# Altium project IOT_CCM_RP2040.PrjPcb
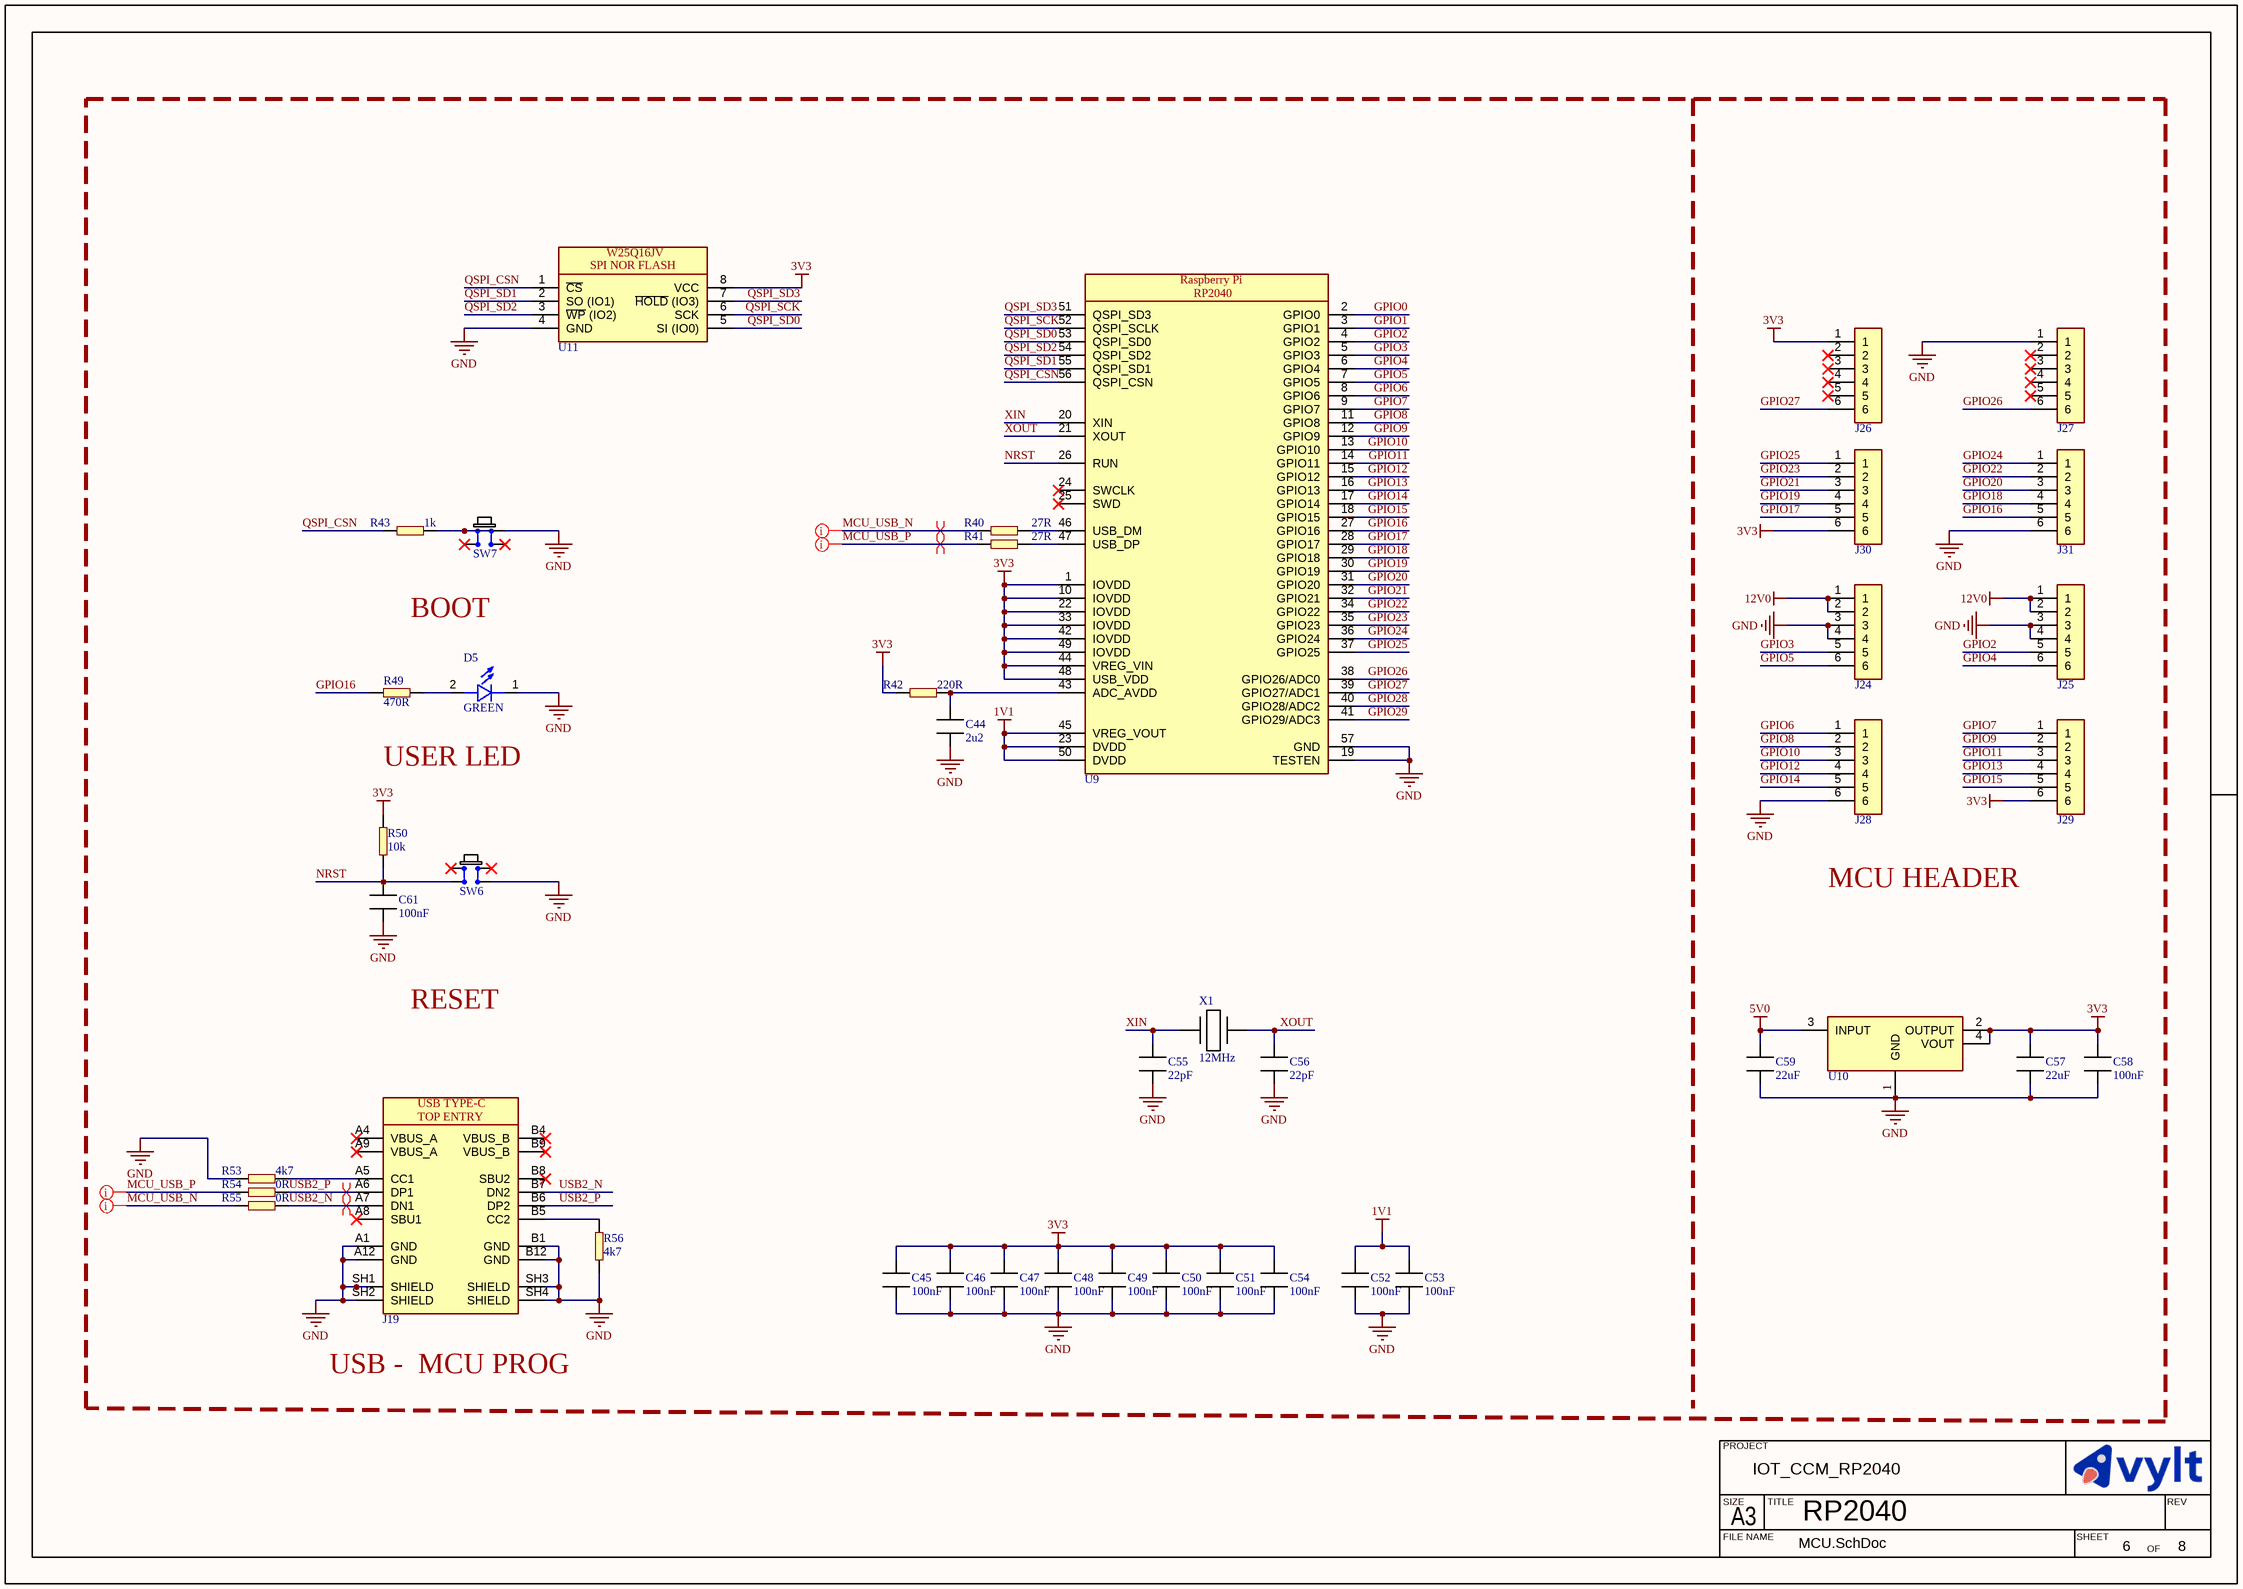
[diagram p0: MCU.SchDoc]
SheetTotal: 8; Rev: 1.0; Project: IOT_CCM_RP2040
1 sheet, 43 parts. Net scope: global (net labels, ports and power ports of the same name join across sheets).
Board file: IOT_CCM_RP2040.PcbDoc

## Sheet MCU.SchDoc: RP2040
size 420 x 297 mm; Revision: 1.0; SheetNumber: 6

### Parts
C44  value 2u2  [CAPC2012X13L]  (hidden comment: MLCC_0805)
C45  value 100nF  [CAPC2012X13L]  (hidden comment: MLCC_0805)
C46  value 100nF  [CAPC2012X13L]  (hidden comment: MLCC_0805)
C47  value 100nF  [CAPC2012X13L]  (hidden comment: MLCC_0805)
C48  value 100nF  [CAPC2012X13L]  (hidden comment: MLCC_0805)
C49  value 100nF  [CAPC2012X13L]  (hidden comment: MLCC_0805)
C50  value 100nF  [CAPC2012X13L]  (hidden comment: MLCC_0805)
C51  value 100nF  [CAPC2012X13L]  (hidden comment: MLCC_0805)
C52  value 100nF  [CAPC2012X13L]  (hidden comment: MLCC_0805)
C53  value 100nF  [CAPC2012X13L]  (hidden comment: MLCC_0805)
C54  value 100nF  [CAPC2012X13L]  (hidden comment: MLCC_0805)
C55  value 22pF  [CAPC2012X13L]  (hidden comment: MLCC_0805)
C56  value 22pF  [CAPC2012X13L]  (hidden comment: MLCC_0805)
C57  value 22uF  [CAPC2012X13L]  (hidden comment: MLCC_0805)
C58  value 100nF  [CAPC2012X13L]  (hidden comment: MLCC_0805)
C59  value 22uF  [CAPC2012X13L]  (hidden comment: MLCC_0805)
C61  value 100nF  [CAPC2012X13L]  (hidden comment: MLCC_0805)  (no BOM)
D5  value GREEN  [LED_1206]  (hidden comment: LED_1206)
J19  GSB1CA11101DSHR  [GSB1CA11101DSHR]  (value not drawn)
J24  ERP_148-2  [6PX1R_F]  (value not drawn)
J25  ERP_148-2  [6PX1R_F]  (value not drawn)
J26  ERP_148-2  [6PX1R_F]  (value not drawn)
J27  ERP_148-2  [6PX1R_F]  (value not drawn)
J28  ERP_148-2  [6PX1R_F]  (value not drawn)
J29  ERP_148-2  [6PX1R_F]  (value not drawn)
J30  ERP_148-2  [6PX1R_F]  (value not drawn)
J31  ERP_148-2  [6PX1R_F]  (value not drawn)
R40  value 27R  [RES_0603]  (hidden comment: ERP_101-1)
R41  value 27R  [RES_0603]  (hidden comment: ERP_101-1)
R42  value 220R  [RES_0603]  (hidden comment: ERP_101-1)
R43  value 1k  [RES_0603]  (hidden comment: ERP_101-1)
R49  value 470R  [RES_0603]  (hidden comment: ERP_101-1)
R50  value 10k  [RES_0603]  (hidden comment: ERP_101-1)
R53  value 4k7  [RES_0603]  (hidden comment: ERP_101-1)
R54  value 0R  [RES_0603]  (hidden comment: ERP_101-1)
R55  value 0R  [RES_0603]  (hidden comment: ERP_101-1)
R56  value 4k7  [RES_0603]  (hidden comment: ERP_101-1)
SW6  Generic6X6  [Generic6X6]  (value not drawn)
SW7  Generic6X6  [Generic6X6]  (value not drawn)
U9  RP2040  [QFN40P700X700X90-57N]  (value not drawn)
U10  ERP_123-1  [AMS1117_SOT223]  (value not drawn)
U11  W25Q16JV  [SOIC127P600X175-8M]  (value not drawn)
X1  value 12MHz  [X5032]  (hidden comment: X5032)

### Nets
1V1: C52.1 C53.1 U9.23(DVDD) U9.45(VREG_VOUT) U9.50(DVDD)
3V3: C45.1 C46.1 C47.1 C48.1 C49.1 C50.1 C51.1 C54.1 C57.1 C58.1 J26.1 J29.6 J30.6 R42.2 R50.2 U9.1(IOVDD) U9.10(IOVDD) U9.22(IOVDD) U9.33(IOVDD) U9.42(IOVDD) U9.44(VREG_VIN) U9.48(USB_VDD) U9.49(IOVDD) U10.2(OUTPUT) U10.4(VOUT) U11.8(VCC)
5V0: C59.1 U10.3(INPUT)
12V0: J24.1 J24.2 J25.1 J25.2
GND: C44.2 C45.2 C46.2 C47.2 C48.2 C49.2 C50.2 C51.2 C52.2 C53.2 C54.2 C55.2 C56.2 C57.2 C58.2 C59.2 C61.2 D5.1 J19.A1(GND) J19.A12(GND) J19.B1(GND) J19.B12(GND) J19.SH1(SHIELD) J19.SH2(SHIELD) J19.SH3(SHIELD) J19.SH4(SHIELD) J24.3 J24.4 J25.3 J25.4 J27.1 J28.6 J31.6 R53.2 R56.2 SW6.4(COM) SW7.1(NO) U9.19(TESTEN) U9.57(GND) U10.1(GND) U11.4(GND)
GPIO0: U9.2(GPIO0)
GPIO1: U9.3(GPIO1)
GPIO2: J25.5 U9.4(GPIO2)
GPIO3: J24.5 U9.5(GPIO3)
GPIO4: J25.6 U9.6(GPIO4)
GPIO5: J24.6 U9.7(GPIO5)
GPIO6: J28.1 U9.8(GPIO6)
GPIO7: J29.1 U9.9(GPIO7)
GPIO8: J28.2 U9.11(GPIO8)
GPIO9: J29.2 U9.12(GPIO9)
GPIO10: J28.3 U9.13(GPIO10)
GPIO11: J29.3 U9.14(GPIO11)
GPIO12: J28.4 U9.15(GPIO12)
GPIO13: J29.4 U9.16(GPIO13)
GPIO14: J28.5 U9.17(GPIO14)
GPIO15: J29.5 U9.18(GPIO15)
GPIO16: J31.5 R49.2 U9.27(GPIO16)
GPIO17: J30.5 U9.28(GPIO17)
GPIO18: J31.4 U9.29(GPIO18)
GPIO19: J30.4 U9.30(GPIO19)
GPIO20: J31.3 U9.31(GPIO20)
GPIO21: J30.3 U9.32(GPIO21)
GPIO22: J31.2 U9.34(GPIO22)
GPIO23: J30.2 U9.35(GPIO23)
GPIO24: J31.1 U9.36(GPIO24)
GPIO25: J30.1 U9.37(GPIO25)
GPIO26: J27.6 U9.38(GPIO26/ADC0)
GPIO27: J26.6 U9.39(GPIO27/ADC1)
GPIO28: U9.40(GPIO28/ADC2)
GPIO29: U9.41(GPIO29/ADC3)
MCU_USB_N: R40.2 R55.2
MCU_USB_P: R41.2 R54.2
NRST: C61.1 R50.1 SW6.2(NO) U9.26(RUN)
QSPI_CSN: R43.2 U9.56(QSPI_CSN) U11.1(~{CS})
QSPI_SCK: U9.52(QSPI_SCLK) U11.6(SCK)
QSPI_SD0: U9.53(QSPI_SD0) U11.5(SI_(IO0))
QSPI_SD1: U9.55(QSPI_SD1) U11.2(SO_(IO1))
QSPI_SD2: U9.54(QSPI_SD2) U11.3(~{WP}_(IO2))
QSPI_SD3: U9.51(QSPI_SD3) U11.7(~{HOLD}_(IO3))
USB2_N: J19.A7(DN1) J19.B7(DN2) R55.1
USB2_P: J19.A6(DP1) J19.B6(DP2) R54.1
XIN: C55.1 U9.20(XIN) X1.1
XOUT: C56.1 U9.21(XOUT) X1.2
NetC44_1: C44.1 R42.1 U9.43(ADC_AVDD)
NetD5_2: D5.2 R49.1
NetJ19_A5: J19.A5(CC1) R53.1
NetJ19_B5: J19.B5(CC2) R56.1
NetR40_1: R40.1 U9.46(USB_DM)
NetR41_1: R41.1 U9.47(USB_DP)
NetR43_1: R43.1 SW7.3(COM)

Not connected (* = marked no-connect by the designer): J19 A4(VBUS_A)* A8(SBU1)* A9(VBUS_A)* B4(VBUS_B)* B8(SBU2)* B9(VBUS_B)*; J26 2* 3* 4* 5*; J27 2* 3* 4* 5*; SW6 1(NO)* 3(COM)*; SW7 2(NO)* 4(COM)*; U9 24(SWCLK)* 25(SWD)*

### Layout directives
differential pair; rule Differential Pairs Routing [Pref Gap = 7.006mil    Min Gap  = 7.006mil    Max Gap  = 7.006milPref Width = 7.275mil    Min Width  = 7.275mil    Max Width  = 7.275mil]: MCU_USB_P, USB2_N, USB2_P
rule Differential Pairs Routing [Pref Gap = 7.006mil    Min Gap  = 7.006mil    Max Gap  = 7.006milPref Width = 7.275mil    Min Width  = 7.275mil    Max Width  = 7.275mil]: MCU_USB_N, MCU_USB_P
rule Differential Pairs Routing [Pref Gap = 0.178mm    Min Gap  = 0.178mm    Max Gap  = 0.178mmPref Width = 0.185mm    Min Width  = 0.185mm    Max Width  = 0.185mm]; rule Routing Via Style [Pref Size = 0.8mm    Pref Hole Size = 0.4mm]: MCU_USB_N
rule Differential Pairs Routing [Pref Gap = 7.006mil    Min Gap  = 7.006mil    Max Gap  = 7.006milPref Width = 7.275mil    Min Width  = 7.275mil    Max Width  = 7.275mil]; rule Routing Via Style [Pref Size = 0.8mm    Pref Hole Size = 0.4mm]: MCU_USB_P
differential pair; rule Differential Pairs Routing [Pref Gap = 0.178mm    Min Gap  = 0.178mm    Max Gap  = 0.178mmPref Width = 0.185mm    Min Width  = 0.185mm    Max Width  = 0.185mm]: MCU_USB_N

### Notes on the sheet
- BOOT
- USER LED
- MCU HEADER
- RESET
- (near J19) USB -  MCU PROG
- PROJECT
- SIZE
- FILE NAME
- A3
- TITLE
- SHEET
- OF
- REV
- (in symbol GSB1CA11101DSHR) USB TYPE-C; TOP ENTRY
- (in symbol W25Q16JV) SPI NOR FLASH

### Library data of the parts
C44-C59 C61 = MLCC_0805: Chip Capacitor, 2-Leads, Body 2.00x1.25mm, IPC High Density; Package: 0805; Manufacturer 1: *; Manufacturer Part Number 1: *
D5 = LED_1206: LED CLEAR 1206 SMD; Manufacturer Part Number 1: 6395; Manufacturer 1: Sunrom
J19 = GSB1CA11101DSHR: USB-C (USB TYPE-C) USB 2.0 Receptacle Connector 24 (16+8 Dummy) Position Surface Mount, Through Hole; Manufacturer 1: Amphenol ICC (Commercial Products); Value: MUP-U23010-02; Manufacturer Part Number 1: GSB1CA11101DSHR; Package: 24 (16+8 Dummy)
J24-J31 = 6PX1R_F: 6PX1R Female Header; Value: *; Manufacturer 1: *; Manufacturer Part Number 1: *
R40-R43 R49 R50 R53-R56 = RES_0603: Package: 0603; Manufacturer 1: *; Manufacturer Part Number 1: *
  R49: ERP: *
SW6 SW7 = Generic6X6: Tactile Switch SPST-NO Top Actuated Surface Mount; Manufacturer 1: C&K; Manufacturer Part Number 1: *; Package: 4.5X4.5
U9 = RP2040: ARM® Cortex®-M0+ - Microcontroller IC 32-Bit Dual-Core 133MHz External Program Memory 56-QFN (7x7); Manufacturer 1: Raspberry Pi; Package: QFN56; Value: *; Supplier Part Number 1: *; Supplier 1: *; Manufacturer Part Number 1: RP2040
U10 = AMS1117_SOT223: AMS1117 LDO; Manufacturer 1: TI; Supplier  Part Number 1: *; Supplier  1: *; Package: SOT223; Manufacturer Part Number 1: *
U11 = W25Q16JV: FLASH - NOR Memory IC SPI - Quad I/O 133 MHz 8-SOIC; Manufacturer 1: Winbond; Manufacturer Part Number 1: W25Q16JVSNIQ; Package: 8-SOIC; Value: *
X1 = X5032: CRYSTAL X5032 2 Pin; Package: HC-49US; ERP: *; Manufacturer Part Number 1: *; Manufacturer 1: *